# Altium schematic sheet CAN.SchDoc
size A4; SheetNumber: 3; SheetTotal: 6
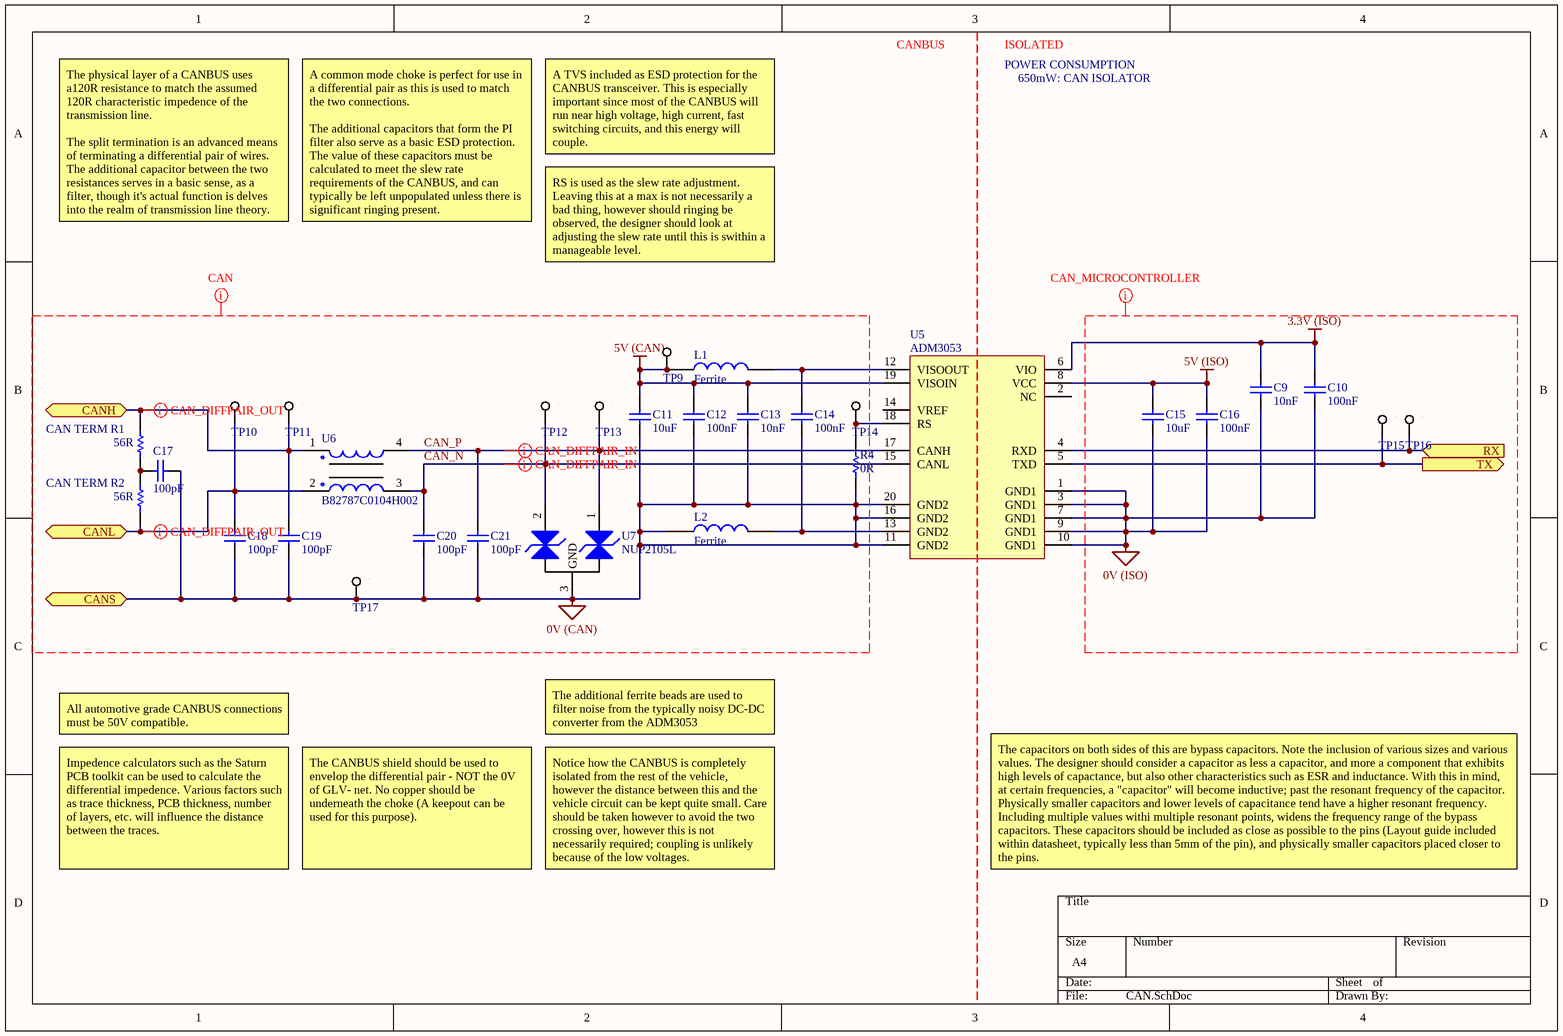
[diagram p0: CAN.SchDoc]

## Parts
C9  10nF  [1206]
C10  100nF  [0805]
C11  10uF  [0805]
C12  100nF  [0805]
C13  10nF  [1206]
C14  100nF  [0805]
C15  10uF  [0805]
C16  100nF  [0805]
C17  100pF  [0805]
C18  100pF  [0805]
C19  100pF  [0805]
C20  100pF  [0805]
C21  100pF  [0805]
CAN_TERM_R1  56R  [0805]
CAN_TERM_R2  56R  [0805]
L1  Ferrite  [0805]
L2  Ferrite  [0805]
R4  0R  [0805]
TP9  0mm  [SMD Test Point 1mm]  (value not drawn)
TP10  0mm  [SMD Test Point 1mm]  (value not drawn)
TP11  0mm  [SMD Test Point 1mm]  (value not drawn)
TP12  0mm  [SMD Test Point 1mm]  (value not drawn)
TP13  0mm  [SMD Test Point 1mm]  (value not drawn)
TP14  0mm  [SMD Test Point 1mm]  (value not drawn)
TP15  0mm  [SMD Test Point 1mm]  (value not drawn)
TP16  0mm  [SMD Test Point 1mm]  (value not drawn)
TP17  0mm  [SMD Test Point 1mm]  (value not drawn)
U5  ADM3053  [AD SOIC-W 20]
U6  B82787C0104H002  [TDK 4-PC Pad]
U7  NUP2105L  [ON SOT-23]

## Ports
CANH (bidir), CANL (bidir), CANS (bidir), RX (in), TX (out)

## Nets
0V (CAN): C11.1 C12.1 C13.1 C17.2 C18.1 C19.1 C20.1 C21.1 L2.2 R4.1 TP17.1 U5.11(GND2) U5.16(GND2) U5.20(GND2) U7.3(GND) ; port CANS
0V (ISO): C9.1 C10.1 C15.1 C16.1 U5.1(GND1) U5.3(GND1) U5.7(GND1) U5.9(GND1) U5.10(GND1)
3.3V (ISO): C9.2 C10.2 U5.6(VIO)
5V (CAN): C11.2 C12.2 C13.2 L1.2 TP9.1 U5.19(VISOIN)
5V (ISO): C15.2 C16.2 U5.8(VCC)
CAN_N: C20.2 TP12.1 U5.15(CANL) U6.3 U7.2(CAN_L)
CAN_P: C21.2 TP13.1 U5.17(CANH) U6.4 U7.1(CAN_H)
CANH: C19.2 CAN_TERM_R1.2 TP11.1 U6.1 ; port CANH
CANL: C18.2 CAN_TERM_R2.1 TP10.1 U6.2 ; port CANL
RX: TP16.1 U5.4(RXD) ; port RX
TX: TP15.1 U5.5(TXD) ; port TX
NetC14_1: C14.1 L2.1 U5.13(GND2)
NetC14_2: C14.2 L1.1 U5.12(VISOOUT)
NetC17_1: C17.1 CAN_TERM_R1.1 CAN_TERM_R2.2
NetR4_2: R4.2 TP14.1 U5.18(RS)

Not connected (* = marked no-connect by the designer): U5 2(NC) 14(VREF)

## Layout directives
net class CAN_NET: 0V (CAN), 5V (CAN), CAN_N, CAN_P
net class MICROCONTROLLER: 0V (ISO), 3.3V (ISO), 5V (ISO)
differential pair; differential pair class CAN_DIFFPAIR_IN: CAN_N, CAN_P
differential pair; differential pair class CAN_DIFFPAIR_OUT: CANH, CANL

## Notes on the sheet
- CANBUS
- ISOLATED
- POWER CONSUMPTION
- 650mW: CAN ISOLATOR
- A TVS included as ESD protection for the CANBUS transceiver. This is especially important since most of the CANBUS will run near high voltage, high current, fast switching circuits, and this energy will couple.
- The physical layer of a CANBUS uses a120R resistance to match the assumed 120R characteristic impedence of the transmission line.
  The split termination is an advanced means of terminating a differential pair of wires. The additional capacitor between the two resistances serves in a basic sense, as a filter, though it's actual function is delves into the realm of transmission line theory.
- A common mode choke is perfect for use in a differential pair as this is used to match the two connections.
  The additional capacitors that form the PI filter also serve as a basic ESD protection. The value of these capacitors must be calculated to meet the slew rate requirements of the CANBUS, and can typically be left unpopulated unless there is significant ringing present.
- RS is used as the slew rate adjustment. Leaving this at a max is not necessarily a bad thing, however should ringing be observed, the designer should look at adjusting the slew rate until this is swithin a manageable level.
- All automotive grade CANBUS connections must be 50V compatible.
- The additional ferrite beads are used to filter noise from the typically noisy DC-DC converter from the ADM3053
- Impedence calculators such as the Saturn PCB toolkit can be used to calculate the differential impedence. Various factors such as trace thickness, PCB thickness, number of layers, etc. will influence the distance between the traces.
- The CANBUS shield should be used to envelop the differential pair - NOT the 0V of GLV- net. No copper should be underneath the choke (A keepout can be used for this purpose).
- Notice how the CANBUS is completely isolated from the rest of the vehicle, however the distance between this and the vehicle circuit can be kept quite small. Care should be taken however to avoid the two crossing over, however this is not necessarily required; coupling is unlikely because of the low voltages.
- The capacitors on both sides of this are bypass capacitors. Note the inclusion of various sizes and various values. The designer should consider a capacitor as less a capacitor, and more a component that exhibits high levels of capactance, but also other characteristics such as ESR and inductance. With this in mind, at certain frequencies, a "capacitor" will become inductive; past the resonant frequency of the capacitor. Physically smaller capacitors and lower levels of capacitance tend have a higher resonant frequency. Including multiple values withi multiple resonant points, widens the frequency range of the bypass capacitors. These capacitors should be included as close as possible to the pins (Layout guide included within datasheet, typically less than 5mm of the pin), and physically smaller capacitors placed closer to the pins.

## Library data of the parts
C9 C13 = GCM3195C2A103JA16D: Manufacturer: muRata; Tolerance: 5%; Material: Ceramic; Rated Voltage: 100V; Part Number: GCM3195C2A103JA16D; Value: 10nF; Digikey Part Number: 490-4978-2-ND
C10 C12 C14 C16 = GCM21BR71E104KA37L: Manufacturer: muRata; Tolerance: 10%; Material: X7R; Rated Voltage: 25V; Part Number: GCM21BR71E104KA37L; Value: 100nF; Digikey Part Number: DO NOT USE FOR NEW DESIGNS
C11 C15 = GRM21BR6YA106KE43L: Manufacturer: muRata; Tolerance: 10%; Material: X5R; Rated Voltage: 50V; Part Number: GRM21BR6YA106KE43L; Value: 10uF; Digikey Part Number: 490-10514-6-ND
C17-C21 = GCM21B5C1H101JA37L: Manufacturer: muRata; Tolerance: 5%; Material: C0G; Rated Voltage: 50V; Part Number: GCM21B5C1H101JA37L; Value: 100pF; Digikey Part Number: DO NOT USE FOR NEW DESIGNS
CAN_TERM_R1 CAN_TERM_R2 = RC0805FR0756RL: Manufacturer: YAGEO; Tolerance: 0.01; Rated Voltage: 0.125W; Part Number: RC0805FR0756RL; Value: 56R; Material: FR-07; Digikey Part Number: 311-56.0CRCT-ND
L1 L2 = MMZ2012Y202BTD25: Manufacturer: TDK Corportation; Impedence: 2 kOhms @ 100MHz; Material: Ferrite Bead; Rated Current: 400mA; Part Number: MMZ2012Y202BTD25; Value: Ferrite; Digikey Part Number: 445-172872-1-ND
R4 = RC0805FR070RL: Manufacturer: YAGEO; Tolerance: 0.01; Rated Voltage: 0.125W; Part Number: RC0805FR070RL; Value: 0R; Material: FR-07; Digikey Part Number: 311-0.0CRCT-ND
TP9-TP17 = SMD Test Point Small: Positions: 1; Row Spacing: 0; Flange: No; Contact: NA; Part Number: SMD Test Point Small; Pitch: 0mm; Angle: 0
U5 = ADM3053: Isolated CAN Transceiver; Manufacturer: Analogue Devices; Part Number: ADM3053; Digikey Part Number: ADM3053BRWZ-ND; Digikey Link: https://www.digikey.com/product-detail/en/analog-devices-inc/ADM3053BRWZ/ADM3053BRWZ-ND/2709332
U6 = B82787C0104H002: 100µH @ 100kHz 2 Line Common Mode Choke Surface Mount 5.8 kOhms @ 10MHz 150mA DCR 2Ohm; Manufacturer: EPCOS (TDK); Part Number: B82787C0104H002; Impedence: 5.8 kOhms @ 10MHz; Material: Wirewound; Rated Current: 150mA; Digikey Part Number: 495-4598-1-ND; Digikey Link: https://www.digikey.com/product-detail/en/epcos-tdk/B82787C0104H002/495-4598-2-ND/3680998; Value: 100µH @ 100kHz
U7 = NUP2105L: Dual Line CAN Bus Protector; Manufacturer: ON Semiconductor; Part Number: NUP2105L; Digikey Part Number: NUP2105LT1GOSCT-ND; Digikey Link: https://www.digikey.com/product-detail/en/on-semiconductor/NUP2105LT1G/NUP2105LT1GOSCT-ND/1485001